# EAGLE design boot_rig_esp (EAGLE 7.7.0)
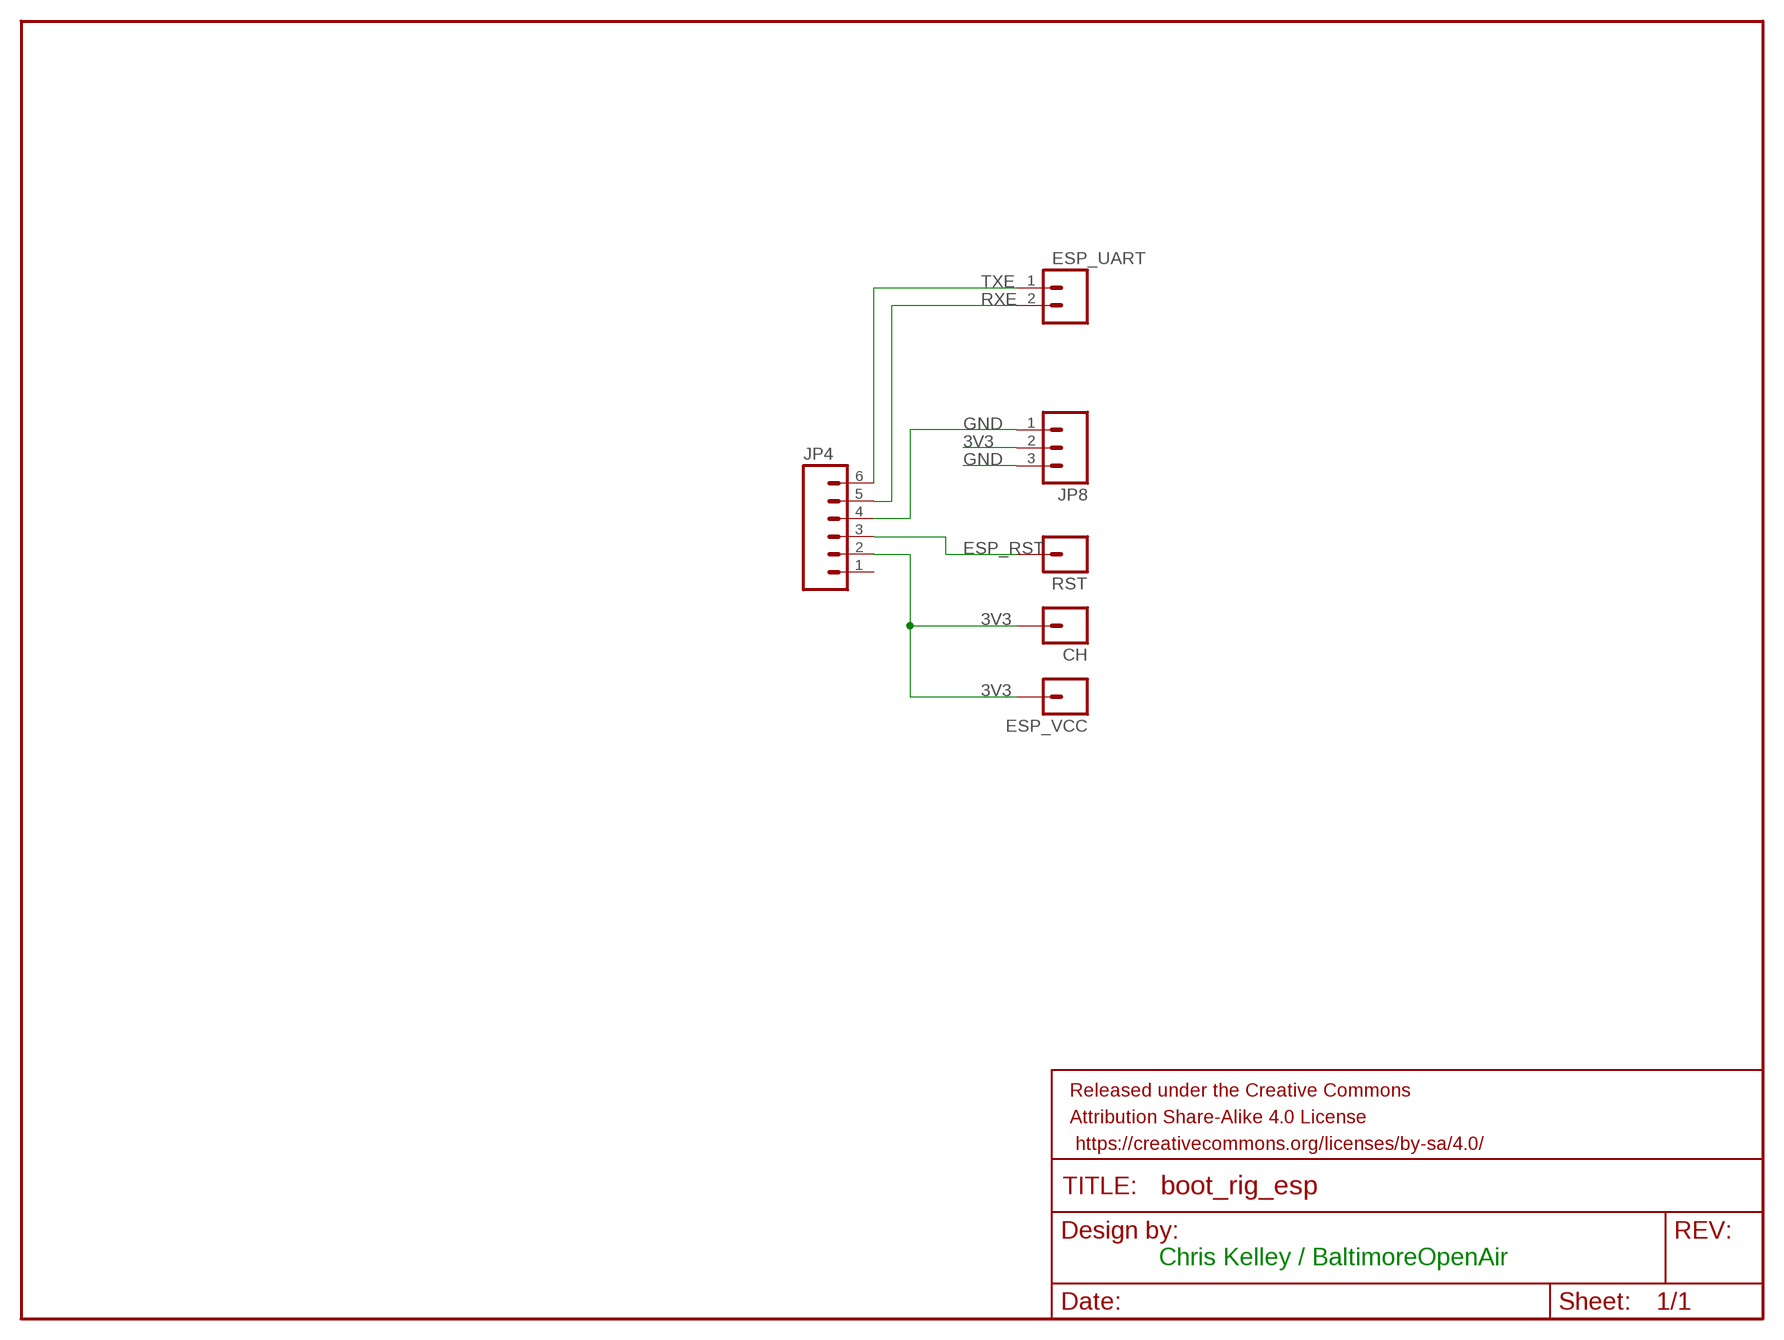
[diagram p0: schematic, sheet 1]

## Parts
CH  M01PTH  [1X01]
ESP_UART  M02PTH  [1X02]
ESP_VCC  M01PTH  [1X01]
FRAME1  FRAME-LETTER  [CREATIVE_COMMONS]
JP4  M06SILK_FEMALE_PTH  [1X06]
JP8  M03PTH  [1X03]
RST  M01PTH  [1X01]

## Nets
3V3: CH.1 ESP_VCC.1 JP4.2 JP8.2
ESP_RST: JP4.3 RST.1
GND: JP4.4 JP8.1 JP8.3
RXE: ESP_UART.2 JP4.5
TXE: ESP_UART.1 JP4.6
Unconnected: JP4.1

## Notes on the sheet
- Chris Kelley / BaltimoreOpenAir

## Library data of the parts
CH ESP_VCC RST = SparkFun-Connectors:M01: Header 1 Standard 1-pin 0.1" header. Use with straight break away headers (SKU : PRT-00116), right angle break away headers (PRT-00553), swiss pins (PRT-00743), machine pins (PRT-00117), and female headers (PRT-00115).
ESP_UART = SparkFun-Connectors:M02: Standard 2-pin 0.1" header. Use with - straight break away headers ( PRT-00116) - right angle break away headers (PRT-00553) - swiss pins (PRT-00743) - machine pins (PRT-00117) - female headers (PRT-00115) Molex polarized connector foot print use with: PRT-08233 with associated crimp pins and housings. 2.54_SCREWTERM for use with PRT-10571. 3.5mm Screw Terminal footprints for PRT-08084 5mm Screw Terminal footprints for use with PRT-08432
FRAME1 = SparkFun-Aesthetics:FRAME-LETTER: Schematic Frame Standard 8.5x11 US Letter frame
JP4 = SparkFun-Connectors:M06: Header 6 Standard 6-pin 0.1" header. Use with straight break away headers (SKU : PRT-00116), right angle break away headers (PRT-00553), swiss pins (PRT-00743), machine pins (PRT-00117), and female headers (PRT-00115). Molex polarized connector foot print use with SKU : PRT-08094 with associated crimp pins and housings. NOTES ON THE VARIANTS LOCK and LOCK_LONGPADS... This footprint was designed to help hold the alignment of a through-hole component (i.e. 6-pin header) while soldering it into place. You may notice that each hole has been shifted either up or down by 0.005 of an inch from it's more standard position (which is a perfectly straight line). This slight alteration caused the pins (the squares in the middle) to touch the edges of the holes. Because they are alternating, it causes a "brace" to hold the component in place. 0.005 has proven to be the perfect amount of "off-center" position when using our standard breakaway headers. Although looks a little odd when you look at the bare footprint, once you have a header in there, the alteration is very hard to notice. Also,if you push a header all the way into place, it is covered up entirely on the bottom side. This idea of altering the position of holes to aid alignment will be further integrated into the Sparkfun Library for other footprints. It can help hold any component with 3 or more connection pins.; PROD_ID: CONN-08437
JP8 = SparkFun-Connectors:M03: Header 3 Standard 3-pin 0.1" header. Use with straight break away headers (SKU : PRT-00116), right angle break away headers (PRT-00553), swiss pins (PRT-00743), machine pins (PRT-00117), and female headers (PRT-00115). Molex polarized connector foot print use with SKU : PRT-08232 with associated crimp pins and housings.

## Board
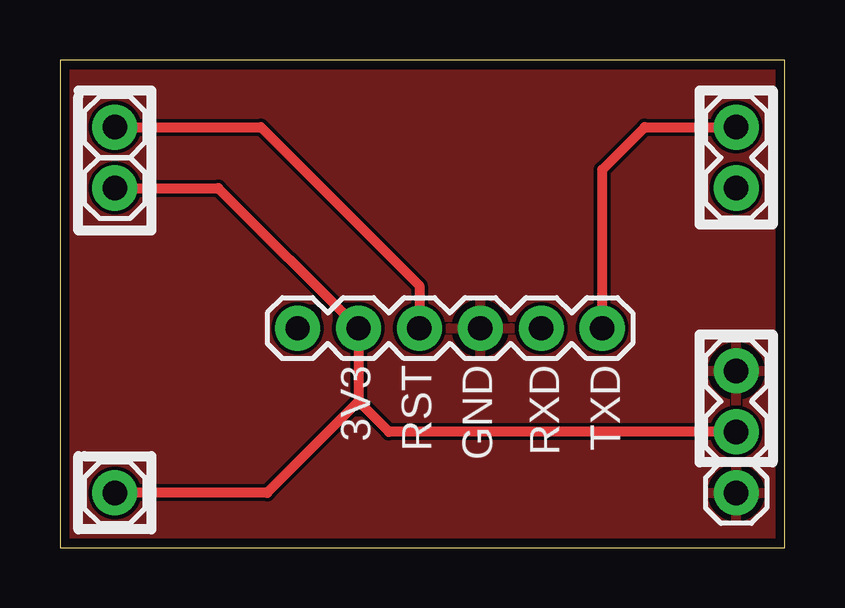
[diagram p1: board, top side]
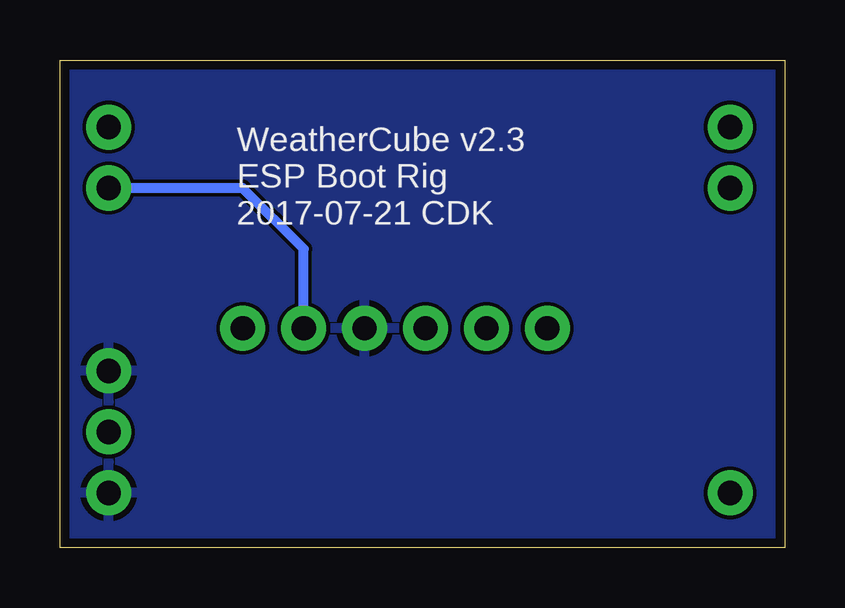
[diagram p2: board, bottom side, seen from below]

Size 30.23 x 20.32 mm. Coordinates in mm from the lower left corner, seen from the top.
Outline: 0,0 30.23,0 30.23,20.32 0,20.32 0,0
Copper layers (1*16): Top 0.0356mm / dielectric 1.5011mm / Bottom 0.0356mm
Design rules "default *": minimum track width 6mil, minimum drill 13mil, track to track 6mil, track to pad 6mil, pad to pad 6mil, via to via 6mil, smd to smd 6mil, copper to edge 15mil, drill to drill 6mil, minimum pad ring 7mil, minimum via ring 7mil, stop-mask expansion 4mil, vias tented up to drill 15mil, thermal gap 10mil

### Footprints (pad centres in the part's own frame; a part is rotated, then mirrored left to right if it is on the bottom)
1X01 = drill 1.016 pad 1.88: 1 0,0
1X02 = drill 1.016 pad 1.88: 1 0,0; 2 2.54,0
1X06 = drill 1.016 pad 1.88: 1 0,0; 2 2.54,0; 3 5.08,0; 4 7.62,0; 5 10.16,0; 6 12.7,0
1X03 = drill 1.016 pad 1.88: 1 0,0; 2 2.54,0; 3 5.08,0

### Placement (x,y rotation side)
CH  2.29,14.99 0 top
ESP_UART  28.19,17.53 270 top
ESP_VCC  2.29,2.29 0 top
FRAME1  3.3,-11.18 0 top  (outside the outline)
JP4  9.91,9.14 0 top
JP8  28.19,7.37 270 top
RST  2.29,17.53 0 top

### Tracks (layer width: path | path; a pad name or v marks a point on that pad's centre or on a via)
3V3
  Top 0.406: 12.45,6.1 JP4.2 6.6,14.99 CH.1 | 12.45,6.1 8.64,2.29 ESP_VCC.1 | JP8.2 13.72,4.83 12.45,6.1
ESP_RST
  Top 0.406: RST.1 8.38,17.53 14.99,10.92 JP4.3
GND
  pour Bottom: -2.79,50.8 69.85,51.56 69.6,-5.08 -2.79,-5.08
  pour Top: -4.57,51.05 68.07,51.82 67.82,-4.83 -4.57,-4.83
RXE
  Bottom 0.406: JP4.5 20.07,12.45 22.61,14.99 ESP_UART.2
TXE
  Top 0.406: JP4.6 22.61,15.75 24.38,17.53 ESP_UART.1

### Text on the board
tPlace: .
bPlace: WeatherCube v2.3 / ESP Boot Rig / 2017-07-21 CDK
tNames: 3V3 | RST | GND | RXD | TXD | Chris Kelley / BaltimoreOpenAir